# Altium schematic sheet Crystal Oscillator.SchDoc
size A; SheetNumber: 6; SheetTotal: 6
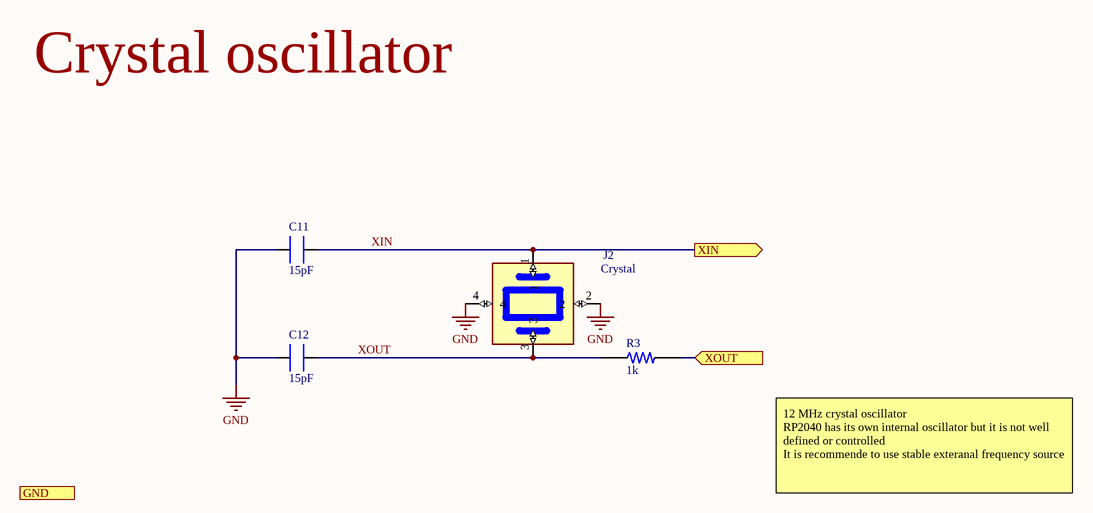
[diagram p0: Crystal Oscillator.SchDoc]

## Parts
C11  15pF  [CC0603JRNPO9BN150]
C12  15pF  [CC0603JRNPO9BN150]
J2  Crystal  [ABM8-272-T3]
R3  1k  [RC0603FR-071KL]

## Ports
GND, XIN (out), XOUT (in)

## Nets
GND: C11.2 C12.2 J2.2 J2.4
XIN: C11.1 J2.1 ; port XIN
XOUT: C12.1 J2.3 R3.1
XOUT: R3.2 ; port XOUT  [a separate net that carries the same name]

## Notes on the sheet
- Crystal oscillator
- 12 MHz crystal oscillator
  RP2040 has its own internal oscillator but it is not well defined or controlled
  It is recommende to use stable exteranal frequency source

## Library data of the parts
C11 C12 = CC0603JRNPO9BN150: 15pF ±5% 50V Ceramic Capacitor C0G, NP0 0603 (1608 Metric); MF: Yageo; Package: 0603 Yageo; MP: CC0603JRNPO9BN150; Purchase-URL: https://pricing.snapeda.com/search/part/CC0603JRNPO9BN150/?ref=eda; Check_prices: https://www.snapeda.com/parts/CC0603JRNPO9BN150/Yageo/view-part/105570/?ref=eda; Value: *; Price: None; Availability: Good; SnapEDA_Link: https://www.snapeda.com/parts/CC0603JRNPO9BN150/Yageo/view-part/105570/?ref=snap
J2 = ABM8-272-T3: 12 MHz  ±30ppm Crystal 10pF 50 Ohms 4-SMD, No Lead; MF: ABRACON; SnapEDA_Link: https://www.snapeda.com/parts/ABM8-272-T3/Abracon/view-part/?ref=snap; Package: SMD-4 Abracon; Value: *; MP: ABM8-272-T3; Check_prices: https://www.snapeda.com/parts/ABM8-272-T3/Abracon/view-part/?ref=eda
R3 = RC0603FR-071KL: 1 kOhms ±1% 0.1W, 1/10W Chip Resistor 0603 (1608 Metric) Moisture Resistant Thick Film; MF: Yageo; SnapEDA_Link: https://www.snapeda.com/parts/RC0603FR-071KL/Yageo/view-part/?ref=snap; Package: 0603 Yageo; Value: *; MP: RC0603FR-071KL; Check_prices: https://www.snapeda.com/parts/RC0603FR-071KL/Yageo/view-part/?ref=eda